# EAGLE design dfx-io (EAGLE 5.11)
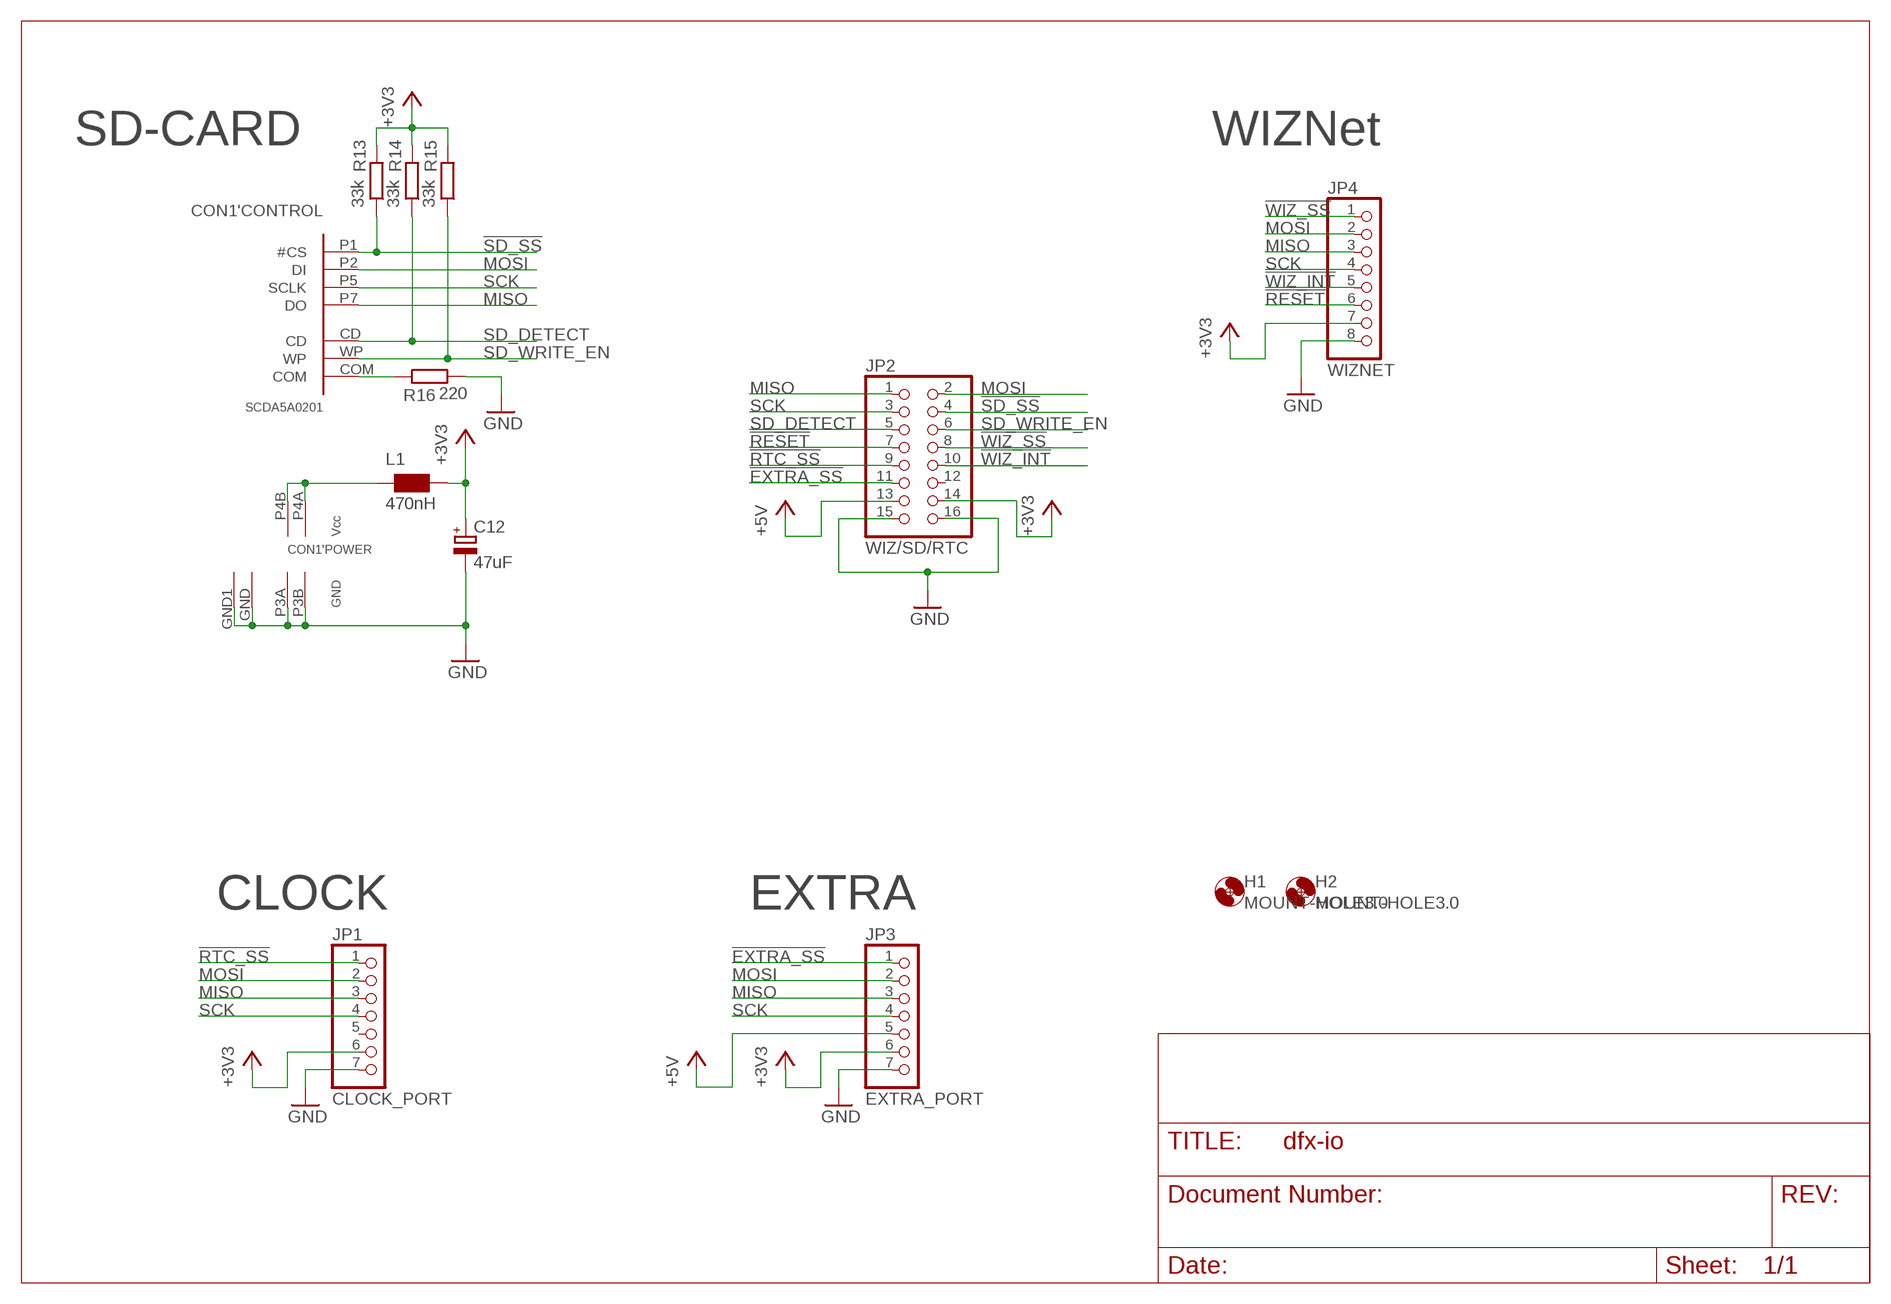
[diagram p0: schematic, sheet 1]

## Parts
C12  47uF  CPOL-EUC  [PANASONIC_C]
CON1  SCDA5A0201  [SCDA5A0201]
H1  MOUNT-HOLE3.0  [3,0]
H2  MOUNT-HOLE3.0  [3,0]
JP1  CLOCK_PORT  PINHD-1X7  [1X07]
JP2  WIZ/SD/RTC  PINHD-2X8  [2X08]
JP3  EXTRA_PORT  PINHD-1X7  [1X07]
JP4  WIZNET  PINHD-1X8  [1X08]
L1  470nH  WE-KIHQ_0805  [WE-KI_0805_B]
R13  33k  R-EU_R0805  [R0805]
R14  33k  R-EU_R0805  [R0805]
R15  33k  R-EU_R0805  [R0805]
R16  220  R-EU_R0805  [R0805]

## Nets
!EXTRA_SS: JP2.11 JP3.1
!RESET: JP2.7 JP4.6
!RTC_SS: JP1.1 JP2.9
!SD_SS: CON1.P1('CONTROL:#CS) JP2.4 R13.1
!WIZ_INT: JP2.10 JP4.5
!WIZ_SS: JP2.8 JP4.1
+3V3: C12.+ JP1.6 JP2.14 JP3.6 JP4.7 L1.1 R13.2 R14.2 R15.2
+5V [POWER]: JP2.13 JP3.5
GND: C12.- CON1.GND1('POWER:GND) CON1.GND('POWER:GND) CON1.P3A('POWER:GND) CON1.P3B('POWER:GND) JP1.7 JP2.15 JP2.16 JP3.7 JP4.8 R16.2
MISO: CON1.P7('CONTROL:DO) JP1.3 JP2.1 JP3.3 JP4.3
MOSI: CON1.P2('CONTROL:DI) JP1.2 JP2.2 JP3.2 JP4.2
N$24: CON1.P4A('POWER:VCC) CON1.P4B('POWER:VCC1) L1.2
N$32: CON1.COM('CONTROL:COM) R16.1
SCK: CON1.P5('CONTROL:SCLK) JP1.4 JP2.3 JP3.4 JP4.4
SD_DETECT: CON1.CD('CONTROL:CD) JP2.5 R14.1
SD_WRITE_EN: CON1.WP('CONTROL:WP) JP2.6 R15.1
Unconnected: JP1.5 JP2.12

## Notes on the sheet
- SD-CARD | WIZNet
- CLOCK | EXTRA

## Library data of the parts
C12 = rcl:CPOL-EU: POLARIZED CAPACITOR, European symbol
CON1 = SCDA5A0201:SCDA5A0201: ALPS Connector for SDMemory Card SD-CARD SCDA5A0201 SPI -MODE
H1 H2 = holes:MOUNT-HOLE: MOUNTING HOLE with drill center marker
JP1 JP3 = pinhead:PINHD-1X7: PIN HEADER
JP2 = pinhead:PINHD-2X8: PIN HEADER
JP4 = pinhead:PINHD-1X8: PIN HEADER
L1 = wuerth-elektronik:WE-KIHQ: SMD Wire Wound Ceramic Inductor WE-KIHQ - High current - Highest Quality factor in size 0805 - up to 98 - High thermal stability - High SRF -- Bluetooth -- Wireless LAN -- RF oscillation circuit -- IF impedance matching -- IG choke
R13-R16 = rcl:R-EU_: RESISTOR, European symbol

## Board
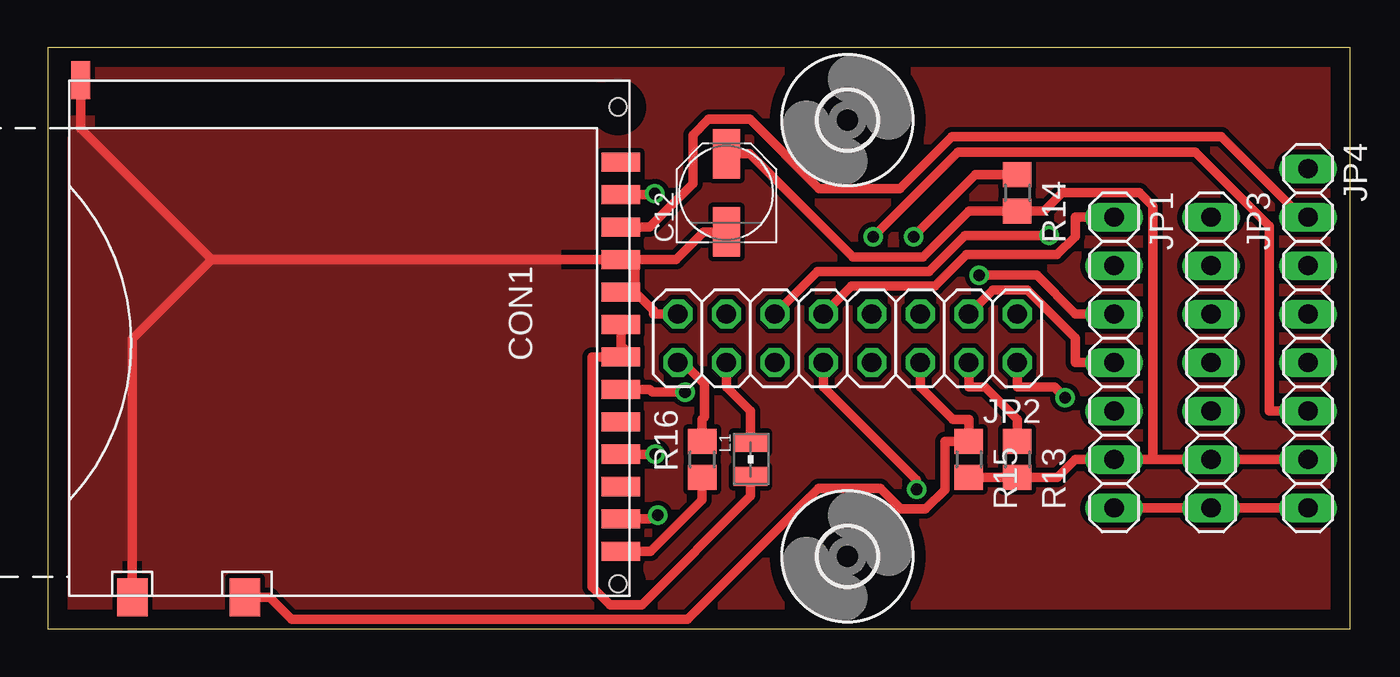
[diagram p1: board, top side]
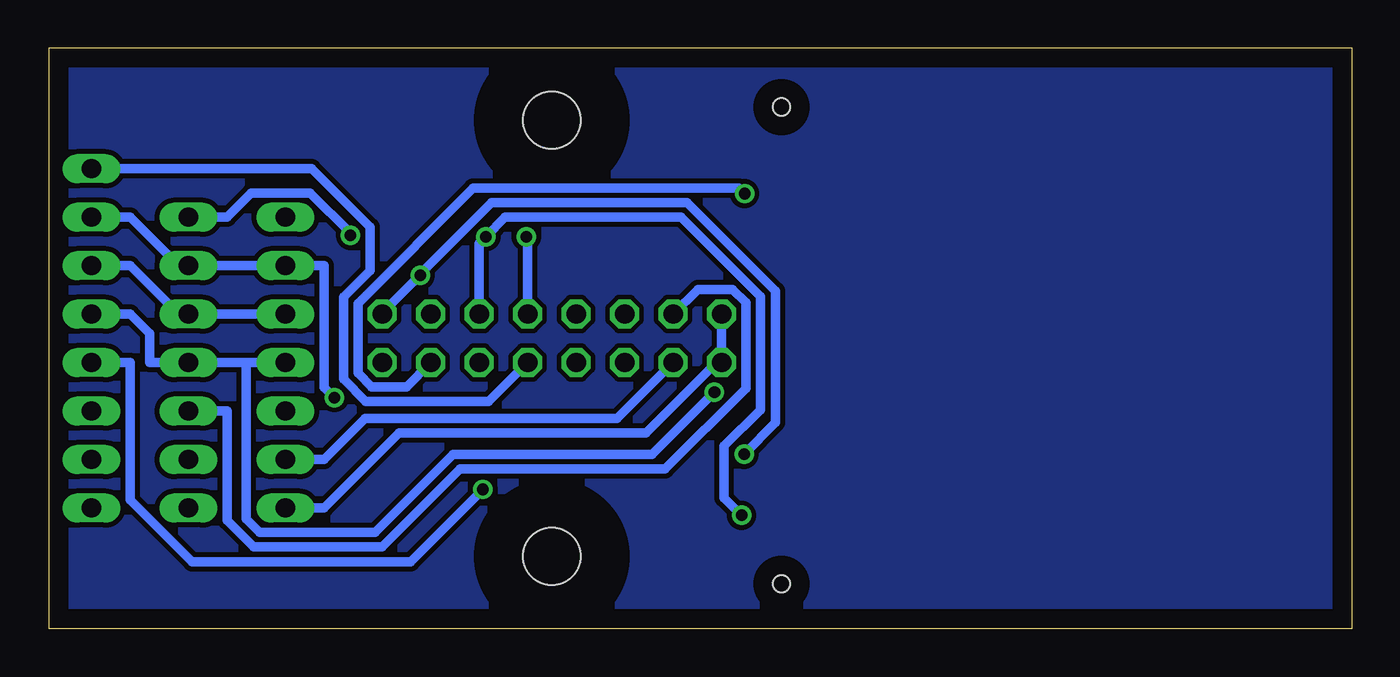
[diagram p2: board, bottom side, seen from below]

Size 68.25 x 30.47 mm. Coordinates in mm from the lower left corner, seen from the top.
Outline: 0,0 68.25,0 68.25,30.47 0,30.47 0,0
Copper layers (1*16): Top 0.035mm / dielectric 1.5mm / Bottom 0.035mm
Design rules "dfx-io": minimum track width 20mil, minimum drill 24mil, track to track 10mil, track to pad 10mil, pad to pad 10mil, via to via 10mil, smd to smd 10mil, copper to edge 40mil, drill to drill 8mil, minimum pad ring 10mil, minimum via ring 8mil, stop-mask expansion 4mil, vias tented up to drill 0mil, thermal gap 10mil
vRestrict: area 1.3,2.5 to 29.2,27.9

### Footprints (pad centres in the part's own frame; a part is rotated, then mirrored left to right if it is on the bottom)
PANASONIC_C = smd 2.6 x 1.4: + 2.05,0; - -2.05,0
SCDA5A0201 = smd 1 x 2: CD 9.475,-0.45; COM 11.175,-0.45; P1 -7.525,-0.45; P2 -5.825,-0.45; P3A -4.125,-0.45; P3B -2.425,-0.45; P4A -0.725,-0.45; P4B 0.975,-0.45; P5 2.675,-0.45; P6 4.375,-0.45; P7 6.075,-0.45; P8 7.775,-0.45; P9 -9.225,-0.45 | smd 2 x 1.6: GND 13.575,-26.05; WP 13.575,-20.15 | smd 2 x 1: GND1 -13.525,-28.75 | hole 0.9: -12.125,-0.6; 12.875,-0.6
3,0 = hole 3: 0,0
1X07 = drill 1.016 long: 1 -7.62,0; 2 -5.08,0; 3 -2.54,0; 4 0,0; 5 2.54,0; 6 5.08,0; 7 7.62,0
2X08 = drill 1.016 octagon: 1 -8.89,-1.27; 2 -8.89,1.27; 3 -6.35,-1.27; 4 -6.35,1.27; 5 -3.81,-1.27; 6 -3.81,1.27; 7 -1.27,-1.27; 8 -1.27,1.27; 9 1.27,-1.27; 10 1.27,1.27; 11 3.81,-1.27; 12 3.81,1.27; 13 6.35,-1.27; 14 6.35,1.27; 15 8.89,-1.27; 16 8.89,1.27
1X08 = drill 1.016 long: 1 -8.89,0; 2 -6.35,0; 3 -3.81,0; 4 -1.27,0; 5 1.27,0; 6 3.81,0; 7 6.35,0; 8 8.89,0
WE-KI_0805_B = smd 1.02 x 1.78: 1 -0.89,0; 2 0.89,0
R0805 = smd 1.3 x 1.5: 1 -0.95,0; 2 0.95,0

### Placement (x,y rotation side)
C12  35.56,22.86 90 top
CON1  30.48,15.24 270 top
H1  41.91,26.67 0 top
H2  41.91,3.81 0 top
JP1  55.88,13.97 270 top
JP2  41.91,15.24 180 top
JP3  60.96,13.97 270 top
JP4  66.04,15.24 270 top
L1  36.83,8.89 270 top
R13  50.8,8.89 270 top
R14  50.8,22.86 270 top
R15  48.26,8.89 270 top
R16  34.29,8.89 90 top

### Tracks (layer width: path | path; a pad name or v marks a point on that pad's centre or on a via)
!EXTRA_SS  (via drill 0.61 pad 1.02)
  Top 0.508: v52.46,20.63 48.07,20.63 46.17,18.74 40.33,18.74 JP2.11
  Bottom 0.508: v52.46,20.63 52.46,20.75 54.58,22.86 57.66,22.86 58.93,21.59 JP3.1
!RESET  (via drill 0.61 pad 1.02)
  Top 0.508: v43.25,20.57 47.68,24.99 60.14,24.99 64.01,21.13 64.01,11.43 JP4.6
  Bottom 0.508: JP2.7 43.18,20.49 v43.25,20.57
!RTC_SS
  Top 0.508: JP2.9 42.1,17.97 46.49,17.97 48.13,19.62 52.88,19.62 53.85,20.58 53.85,21.59 JP1.1
!SD_SS  (via drill 0.61 pad 1.02)
  Top 0.508: v31.81,22.82 31.75,22.77 31.54,22.77 CON1.P1 | JP2.4 48.26,12.7 49.1,12.7 50.8,11 R13.1
  Bottom 0.508: JP2.4 49.53,12.7 51.36,12.7 52.07,13.41 52.07,17.06 46.03,23.11 32.09,23.11 v31.81,22.82
!WIZ_INT  (via drill 0.61 pad 1.02)
  Top 0.508: v45.53,7.32 45.53,7.81 40.64,12.7 JP2.10
  Bottom 0.508: v45.53,7.32 49.32,3.53 60.77,3.53 64.01,6.77 64.01,13.97 JP4.5
!WIZ_SS
  Bottom 0.508: JP2.8 45.22,11.94 51.67,11.94 52.83,13.1 52.83,17.4 51.44,18.8 51.44,21.07 54.5,24.13 JP4.1
+3V3
  Top 0.508: 57.91,8.89 JP3.6 JP4.7 | 57.91,8.89 JP1.6 53.85,8.89 52.9,7.94 R13.2 R15.2 | 57.91,8.89 57.91,22.16 57.2,22.87 53.15,22.87 52.19,21.91 R14.2 50.17,21.91 49.54,21.91 48.27,21.91 45.85,19.5 42.18,19.5 36.77,24.91 C12.+ | JP2.14 35.56,12.7 36.83,11.43 L1.1
  Bottom 0.508: JP2.14 38.49,11.04 51.7,11.04 53.85,8.89 JP1.6
+5V
  Bottom 0.508: JP3.5 58.93,11.43 58.93,5.69 57.54,4.3 50.8,4.3 46.72,8.38 35.99,8.38 31.75,12.62 31.75,17.11 32.44,17.8 34.27,17.8 JP2.13
GND
  Top 0.508: JP2.16 33.28,13.97 34.41,12.84 34.41,11.12 34.29,11 R16.2 | JP2.15 31.75,16.51 31.75,16.7 30.78,17.66 | 30.78,19.36 31.54,19.36 32.91,19.36 34.35,20.81 C12.- | 30.78,19.36 CON1.P3A 8.59,19.36 | 30.78,17.66 CON1.P3B | 30.78,19.36 30.78,17.66 | JP4.8 JP3.7 JP1.7 | CON1.GND1 1.73,26.23 8.59,19.36 | 8.59,19.36 4.43,15.2 CON1.GND
  Bottom 0.508: JP1.7 53.85,6.35 49.92,10.28 36.97,10.28 33.28,13.97 JP2.16 JP2.15
  pour Top: 1.27,26.67 26.67,26.67 26.67,3.81 1.27,3.81
MISO  (via drill 0.61 pad 1.02)
  Top 0.508: JP1.3 53.85,16.51 51.82,18.54 v48.81,18.54 | v31.84,9.16 31.54,9.16 CON1.P7
  Bottom 0.508: v31.84,9.16 30.19,10.81 30.19,17.71 34.82,22.34 45.08,22.34 48.81,18.61 v48.81,18.54 50.67,16.69 50.8,16.69 JP2.1 | JP1.3 JP3.3 61.47,16.51 64.01,19.05 JP4.3
MOSI  (via drill 0.61 pad 1.02)
  Top 0.508: v53.31,12.13 52.74,12.7 50.8,12.7 JP2.2 | CON1.P2 31.54,21.07 33.81,23.34 33.81,25.9 34.63,26.72 36.79,26.72 40.42,23.09 44.65,23.09 47.37,25.81 61.5,25.81 65.72,21.59 JP4.2
  Bottom 0.508: v53.31,12.13 53.85,12.67 53.85,19.05 JP1.2 56.9,19.05 57.91,19.05 JP3.2 61.47,19.05 64.01,21.59 JP4.2
N$2
  pour Top: 0,30.48 68.58,30.48 68.58,0 0,0
N$3
  pour Bottom: 0,30.48 68.58,30.48 68.58,0 0,0
N$24
  Top 0.508: L1.2 36.83,6.98 31.13,1.28 29.46,1.28 28.52,2.22 28.52,14.27 CON1.P4B 30.59,14.27 30.03,14.83 CON1.P4A
N$32
  Top 0.508: CON1.COM 31.54,4.07 31.57,4.07 34.29,6.78 R16.1
SCK  (via drill 0.61 pad 1.02)
  Top 0.508: v33.39,12.42 31.68,12.42 31.54,12.56 CON1.P5 | JP1.4 53.85,13.97 53.85,15.26 51.33,17.78 49.53,17.78 JP2.3
  Bottom 0.508: 57.94,13.97 57.94,5.78 57.23,5.07 51.17,5.07 47.1,9.14 36.67,9.14 v33.39,12.42 | 57.94,13.97 JP1.4 | 57.94,13.97 JP3.4 61.98,13.97 62.99,13.97 62.99,15.49 64.01,16.51 JP4.4
SD_DETECT  (via drill 0.61 pad 1.02)
  Top 0.508: v45.37,20.57 48.61,23.81 49.54,23.81 R14.1 | CON1.CD 31.54,5.76 31.74,5.96 v31.97,5.96
  Bottom 0.508: v31.97,5.96 32.88,6.88 32.88,9.6 30.99,11.49 30.99,17.42 35.14,21.58 44.35,21.58 v45.37,20.57 45.72,20.21 45.72,17.78 JP2.5
SD_WRITE_EN
  Top 0.508: JP2.6 45.72,12.7 47.42,11 48.26,11 R15.1 47,9.84 47,7.29 46,6.29 44.71,6.29 43.62,7.38 40.38,7.38 33.52,0.52 12.79,0.52 11.64,1.67 CON1.WP